# EAGLE schematic SIDEPANELV5 (EAGLE 8.2.2)
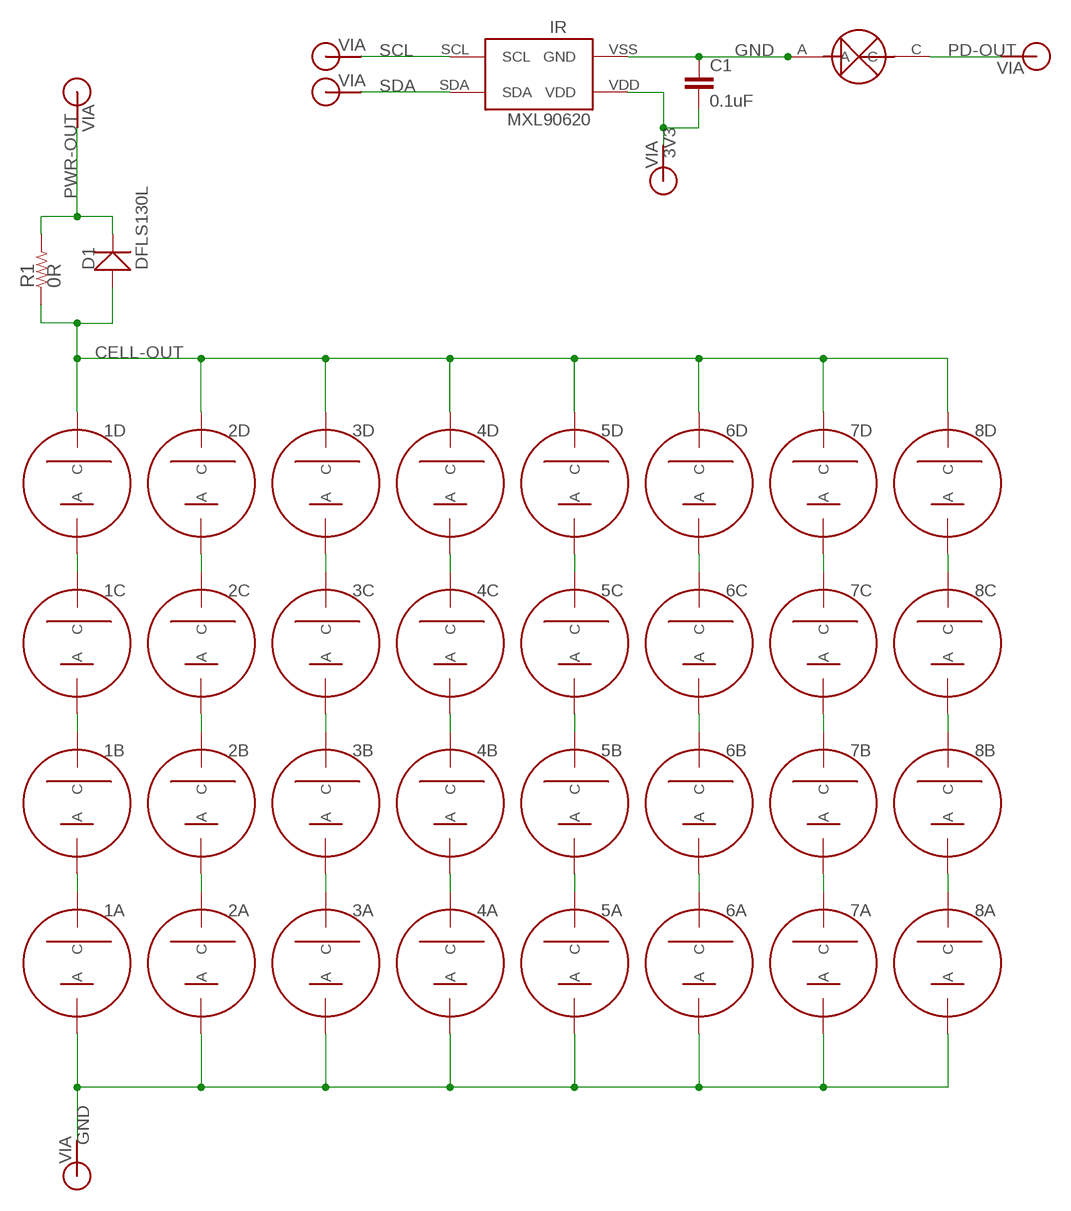
[diagram p0: schematic, sheet 1]

## Parts
1A  SOLARCELLV3  [TRISOLX-V3]
1B  SOLARCELLV3  [TRISOLX-V3]
1C  SOLARCELLV3  [TRISOLX-V3]
1D  SOLARCELLV3  [TRISOLX-V3]
2A  SOLARCELLV3  [TRISOLX-V3]
2B  SOLARCELLV3  [TRISOLX-V3]
2C  SOLARCELLV3  [TRISOLX-V3]
2D  SOLARCELLV3  [TRISOLX-V3]
3A  SOLARCELLV3  [TRISOLX-V3]
3B  SOLARCELLV3  [TRISOLX-V3]
3C  SOLARCELLV3  [TRISOLX-V3]
3D  SOLARCELLV3  [TRISOLX-V3]
3V3  VIA60MIL-SQ  [VIA-60MIL-SQ]
4A  SOLARCELLV3  [TRISOLX-V3]
4B  SOLARCELLV3  [TRISOLX-V3]
4C  SOLARCELLV3  [TRISOLX-V3]
4D  SOLARCELLV3  [TRISOLX-V3]
5A  SOLARCELLV3  [TRISOLX-V3]
5B  SOLARCELLV3  [TRISOLX-V3]
5C  SOLARCELLV3  [TRISOLX-V3]
5D  SOLARCELLV3  [TRISOLX-V3]
6A  SOLARCELLV3  [TRISOLX-V3]
6B  SOLARCELLV3  [TRISOLX-V3]
6C  SOLARCELLV3  [TRISOLX-V3]
6D  SOLARCELLV3  [TRISOLX-V3]
7A  SOLARCELLV3  [TRISOLX-V3]
7B  SOLARCELLV3  [TRISOLX-V3]
7C  SOLARCELLV3  [TRISOLX-V3]
7D  SOLARCELLV3  [TRISOLX-V3]
8A  SOLARCELLV3  [TRISOLX-V3]
8B  SOLARCELLV3  [TRISOLX-V3]
8C  SOLARCELLV3  [TRISOLX-V3]
8D  SOLARCELLV3  [TRISOLX-V3]
C1  0.1uF  CAP0805  [0805]
D1  DFLS130L  [PWRDI-123]
GND  VIA60MIL-SQ  [VIA-60MIL-SQ]
IR  MXL90620  [MXL90620]
PD  PHOTODETECTOR  [PHOTODECTORDEVICE2]
PD-OUT  VIA60MIL-SQ  [VIA-60MIL-SQ]
PWR-OUT  VIA60MIL-SQ  [VIA-60MIL-SQ]
R1  0R  RES1210  [1210]
SCL  VIA60MIL-SQ  [VIA-60MIL-SQ]
SDA  VIA60MIL-SQ  [VIA-60MIL-SQ]

## Nets
3V3: 3V3.P$1 C1.2 IR.VDD
CELL-OUT: 1D.CATHODE(C) 2D.CATHODE(C) 3D.CATHODE(C) 4D.CATHODE(C) 5D.CATHODE(C) 6D.CATHODE(C) 7D.CATHODE(C) 8D.CATHODE(C) D1.A R1.P$1
GND: 1A.ANODE(A) 2A.ANODE(A) 3A.ANODE(A) 4A.ANODE(A) 5A.ANODE(A) 6A.ANODE(A) 7A.ANODE(A) 8A.ANODE(A) C1.1 GND.P$1 IR.VSS(GND) PD.A
N$1: 2C.CATHODE(C) 2D.ANODE(A)
N$2: 1C.CATHODE(C) 1D.ANODE(A)
N$3: 1B.CATHODE(C) 1C.ANODE(A)
N$4: 1A.CATHODE(C) 1B.ANODE(A)
N$5: 2B.CATHODE(C) 2C.ANODE(A)
N$6: 2A.CATHODE(C) 2B.ANODE(A)
N$7: 3C.CATHODE(C) 3D.ANODE(A)
N$8: 3B.CATHODE(C) 3C.ANODE(A)
N$9: 3A.CATHODE(C) 3B.ANODE(A)
N$10: 4C.CATHODE(C) 4D.ANODE(A)
N$11: 4B.CATHODE(C) 4C.ANODE(A)
N$12: 4A.CATHODE(C) 4B.ANODE(A)
N$13: 5C.CATHODE(C) 5D.ANODE(A)
N$15: 5B.CATHODE(C) 5C.ANODE(A)
N$16: 5A.CATHODE(C) 5B.ANODE(A)
N$17: 6C.CATHODE(C) 6D.ANODE(A)
N$18: 6B.CATHODE(C) 6C.ANODE(A)
N$19: 6A.CATHODE(C) 6B.ANODE(A)
N$20: 7C.CATHODE(C) 7D.ANODE(A)
N$21: 7B.CATHODE(C) 7C.ANODE(A)
N$22: 7A.CATHODE(C) 7B.ANODE(A)
N$23: 8C.CATHODE(C) 8D.ANODE(A)
N$24: 8B.CATHODE(C) 8C.ANODE(A)
N$25: 8A.CATHODE(C) 8B.ANODE(A)
PD-OUT: PD-OUT.P$1 PD.C
PWR-OUT: D1.C PWR-OUT.P$1 R1.P$2
SCL: IR.SCL SCL.P$1
SDA: IR.SDA SDA.P$1

## Library data of the parts
1A 1B 1C 1D 2A 2B 2C 2D 3A 3B 3C 3D 4A 4B 4C 4D 5A 5B 5C 5D 6A 6B 6C 6D 7A 7B 7C 7D 8A 8B 8C 8D = BrownSpaceEngineering:SOLARCELLV3
3V3 GND PD-OUT PWR-OUT SCL SDA = BrownSpaceEngineering:VIA
C1 = CNTRL_BOARD:CAP: Capacitor Standard 0603 ceramic capacitor, and 0.1" leaded capacitor.
D1 = BrownSpaceEngineering:DFLS130L
IR = CNTRL_BOARD:MXL90620
PD = Solar Panel Parts:PHOTODETECTOR
R1 = BrownSpaceEngineering:RES